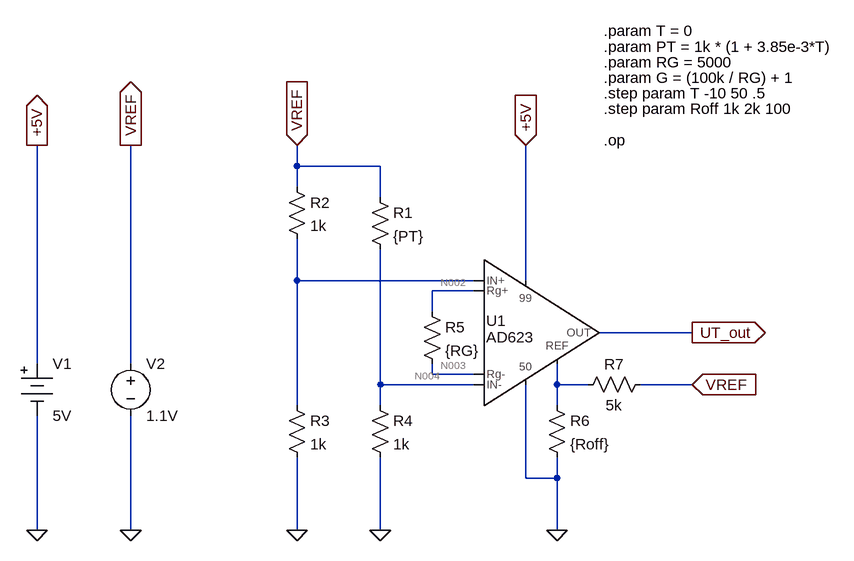
[diagram p0: schematic analog_amplifier.asc]
analog_amplifier.asc, the LTspice schematic file:
Version 4
SHEET 1 880 680
WIRE -96 -128 -96 -160
WIRE 32 -128 -96 -128
WIRE -96 -96 -96 -128
WIRE 32 -80 32 -128
WIRE -96 48 -96 -16
WIRE 176 48 -96 48
WIRE 256 48 256 -160
WIRE 176 64 112 64
WIRE 112 96 112 64
WIRE 512 128 368 128
WIRE -496 176 -496 -160
WIRE -352 176 -352 -160
WIRE 112 192 112 176
WIRE 176 192 112 192
WIRE 32 208 32 0
WIRE 176 208 32 208
WIRE 304 208 304 176
WIRE 352 208 304 208
WIRE 512 208 432 208
WIRE -96 240 -96 48
WIRE 32 240 32 208
WIRE 304 240 304 208
WIRE 256 352 256 208
WIRE 304 352 304 320
WIRE 304 352 256 352
WIRE -496 432 -496 256
WIRE -352 432 -352 256
WIRE -96 432 -96 320
WIRE 32 432 32 320
WIRE 304 432 304 352
FLAG -496 432 0
FLAG -496 -160 +5V
IOPIN -496 -160 Out
FLAG -352 432 0
FLAG -352 -160 VREF
IOPIN -352 -160 Out
FLAG -96 -160 VREF
IOPIN -96 -160 In
FLAG -96 432 0
FLAG 32 432 0
FLAG 304 432 0
FLAG 256 -160 +5V
IOPIN 256 -160 In
FLAG 512 128 UT_out
IOPIN 512 128 Out
FLAG 512 208 VREF
IOPIN 512 208 In
SYMBOL ad623 192 128 R0
WINDOW 3 3 7 Left 2
WINDOW 0 3 -18 Left 2
SYMATTR InstName U1
SYMBOL Misc\\battery -496 160 R0
WINDOW 123 0 0 Left 0
WINDOW 39 0 0 Left 0
SYMATTR InstName V1
SYMATTR Value 5V
SYMBOL voltage -352 160 R0
WINDOW 123 0 0 Left 0
WINDOW 39 0 0 Left 0
SYMATTR InstName V2
SYMATTR Value 1.1V
SYMBOL res 16 -96 R0
SYMATTR InstName R1
SYMATTR Value {PT}
SYMBOL res -112 -112 R0
SYMATTR InstName R2
SYMATTR Value 1k
SYMBOL res -112 224 R0
SYMATTR InstName R3
SYMATTR Value 1k
SYMBOL res 16 224 R0
SYMATTR InstName R4
SYMATTR Value 1k
SYMBOL res 96 80 R0
SYMATTR InstName R5
SYMATTR Value {RG}
SYMBOL res 288 224 R0
SYMATTR InstName R6
SYMATTR Value {Roff}
SYMBOL res 448 192 R90
WINDOW 0 0 56 VBottom 2
WINDOW 3 32 56 VTop 2
SYMATTR InstName R7
SYMATTR Value 5k
TEXT 376 -336 Left 2 !.param T = 0
TEXT 376 -312 Left 2 !.param PT = 1k * (1 + 3.85e-3*T)
TEXT 376 -288 Left 2 !.param RG = 5000
TEXT 376 -264 Left 2 !.param G = (100k / RG) + 1
TEXT 376 -240 Left 2 !.step param T -10 50 .5
TEXT 376 -168 Left 2 !.op
TEXT 376 -216 Left 2 !.step param Roff 1k 2k 100

The netlist it stands for:
* analog_amplifier.asc
XU1 N001 N004 N002 N003 +5V 0 UT_out N005 AD623  ; pins IN+ IN- Rg+ Rg- 99 50 OUT REF
V1 +5V 0 5V
V2 VREF 0 1.1V
R1 VREF N004 {PT}
R2 VREF N001 1k
R3 N001 0 1k
R4 N004 0 1k
R5 N002 N003 {RG}
R6 N005 0 {Roff}
R7 VREF N005 5k
.param T = 0
.param PT = 1k * (1 + 3.85e-3*T)
.param RG = 5000
.param G = (100k / RG) + 1
.step param T -10 50 .5
.op
.step param Roff 1k 2k 100
.lib ad623.cir
.backanno
.end

* Results of the author's LTspice run, read from the files saved beside the schematic
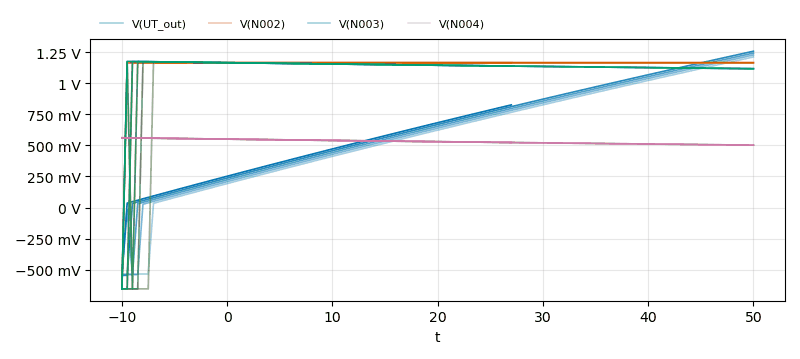
[diagram p1: Operating Point of analog_amplifier.asc, plotted from the saved traces]
* Operating Point, 5 runs:
*   V(UT_out) [roff=1000]: -533.8 mV at t=-10 , 1.21 V at t=50 , min -533.8 mV, max 1.21 V
*   V(UT_out) [roff=1100]: -538.6 mV at t=-10 , 1.226 V at t=50 , min -538.6 mV, max 1.226 V
*   V(UT_out) [roff=1200]: -542.2 mV at t=-10 , 1.242 V at t=50 , min -542.2 mV, max 1.242 V
*   V(UT_out) [roff=1300]: -545 mV at t=-10 , 1.256 V at t=50 , min -545 mV, max 1.256 V
*   V(UT_out) [roff=1400]: -547 mV at t=-10 , 825.2 mV at t=27 , min -547 mV, max 825.2 mV
*   V(N002) [roff=1000]: -653.2 mV at t=-10 , 1.164 V at t=50 , min -653.2 mV, max 1.164 V
*   V(N002) [roff=1100]: -653.2 mV at t=-10 , 1.164 V at t=50 , min -653.2 mV, max 1.164 V
*   V(N002) [roff=1200]: -653.2 mV at t=-10 , 1.164 V at t=50 , min -653.2 mV, max 1.164 V
*   V(N002) [roff=1300]: -653.2 mV at t=-10 , 1.164 V at t=50 , min -653.2 mV, max 1.164 V
*   V(N002) [roff=1400]: -653.2 mV at t=-10 , 1.164 V at t=27 , min -653.2 mV, max 1.164 V
*   V(N003) [roff=1000]: -653.2 mV at t=-10 , 1.116 V at t=50 , min -653.2 mV, max 1.172 V
*   V(N003) [roff=1100]: -653.2 mV at t=-10 , 1.116 V at t=50 , min -653.2 mV, max 1.173 V
*   V(N003) [roff=1200]: -653.2 mV at t=-10 , 1.116 V at t=50 , min -653.2 mV, max 1.175 V
*   V(N003) [roff=1300]: -653.2 mV at t=-10 , 1.116 V at t=50 , min -653.2 mV, max 1.174 V
*   V(N003) [roff=1400]: -653.2 mV at t=-10 , 1.137 V at t=27 , min -653.2 mV, max 1.175 V
*   V(N004) [roff=1000]: 560.8 mV at t=-10 , 501.7 mV at t=50 , min 501.7 mV, max 560.8 mV
*   V(N004) [roff=1100]: 560.8 mV at t=-10 , 501.7 mV at t=50 , min 501.7 mV, max 560.8 mV
*   V(N004) [roff=1200]: 560.8 mV at t=-10 , 501.7 mV at t=50 , min 501.7 mV, max 560.8 mV
*   V(N004) [roff=1300]: 560.8 mV at t=-10 , 501.7 mV at t=50 , min 501.7 mV, max 560.8 mV
*   V(N004) [roff=1400]: 560.8 mV at t=-10 , 522.8 mV at t=27 , min 522.8 mV, max 560.8 mV
* From the log:
*   Semiconductor Device Operating Points:
*                           --- Diodes ---
*   Name:   d:u1:n1d    d:u1:n1c    d:u1:n1b     d:u1:6d     d:u1:5d
*   Model:  u1:dnoi1    u1:dnoi1    u1:dnoi1      u1:dx       u1:dx
*   Id:      5.57e-04    5.57e-04    5.57e-04   -6.29e-13   -3.17e-12
*   Vd:      6.40e-01    6.40e-01    6.40e-01   -6.29e-01   -3.17e+00
*   Req:     4.64e+01    4.64e+01    4.64e+01    1.00e+12    1.00e+12
*   CAP:     0.00e+00    0.00e+00    0.00e+00    0.00e+00    0.00e+00
*   Name:    d:u1:2d     d:u1:1d     d:u1:6c     d:u1:5c     d:u1:2c
*   Model:    u1:dx       u1:dx       u1:dx       u1:dx       u1:dx
*   Id:     -2.50e-12   -2.50e-12   -6.29e-13   -3.17e-12   -2.50e-12
*   Vd:     -2.50e+00   -2.50e+00   -6.29e-01   -3.17e+00   -2.50e+00
*   Req:     1.00e+12    1.00e+12    1.00e+12    1.00e+12    1.00e+12
*   CAP:     0.00e+00    0.00e+00    0.00e+00    0.00e+00    0.00e+00
*   Name:    d:u1:1c     d:u1:6b     d:u1:5b     d:u1:2b     d:u1:1b
*   Model:    u1:dx       u1:dx       u1:dx       u1:dx       u1:dx
*   Id:     -2.50e-12   -1.33e-12   -2.47e-12    1.44e-08   -5.49e-12
*   Vd:     -2.50e+00   -1.33e+00   -2.47e+00    4.86e-01   -5.49e+00
*   Req:     1.00e+12    1.00e+12    1.00e+12    1.80e+06    1.00e+12
*   CAP:     0.00e+00    0.00e+00    0.00e+00    0.00e+00    0.00e+00
*                           --- Bipolar Transistors ---
*   Name:     q:u1:4d     q:u1:4c     q:u1:4b     q:u1:3d     q:u1:3c
*   Model:    u1:qnox     u1:qnox     u1:qnox     u1:qpox     u1:qpox
*   Ib:      -1.04e-11   -1.04e-11   -9.76e-12   -2.04e-01   -2.04e-01
*   Ic:       4.62e-12    4.62e-12    4.62e-12    2.01e-05    2.31e-05
*   Vbe:     -5.76e+00   -5.76e+00   -5.14e+00   -8.23e-01   -8.23e-01
*   Vbc:     -4.61e+00   -4.61e+00   -4.61e+00   -8.06e-01   -8.07e-01
*   Vce:     -1.15e+00   -1.15e+00   -5.34e-01   -1.70e-02   -1.69e-02
*   BetaDC:  -4.45e-01   -4.45e-01   -4.73e-01   -9.84e-05   -1.13e-04
*   Gm:      -8.27e-91   -8.23e-91   -9.60e-91    7.76e+00    7.76e+00
*   Rpi:      1.00e+12    1.00e+12    1.00e+12    7.19e+00    7.19e+00
*   Rx:       0.00e+00    0.00e+00    0.00e+00    0.00e+00    0.00e+00
*   Ro:       1.21e+90    1.22e+90    1.04e+90    1.30e-01    1.30e-01
*   Cbe:      0.00e+00    0.00e+00    0.00e+00    0.00e+00    0.00e+00
*   Cbc:      0.00e+00    0.00e+00    0.00e+00    0.00e+00    0.00e+00
*   Cjs:      0.00e+00    0.00e+00    0.00e+00    0.00e+00    0.00e+00
*   BetaAC:  -8.27e-79   -8.23e-79   -9.60e-79    5.58e+01    5.58e+01
*   Cbx:      0.00e+00    0.00e+00    0.00e+00    0.00e+00    0.00e+00
*   Ft:       0.00e+00    0.00e+00    0.00e+00    0.00e+00    0.00e+00
*   Name:     q:u1:3b     q:u1:2d     q:u1:1d     q:u1:2c     q:u1:1c
*   Model:    u1:qpox     u1:qpi      u1:qpi      u1:qpi      u1:qpi
*   Ib:      -1.84e-01   -9.87e-06    2.33e-12   -9.87e-06    2.31e-12
*   Ic:      -2.03e-06   -1.28e-07   -1.17e-12   -1.28e-07   -1.16e-12
*   Vbe:     -8.21e-01   -6.72e-01    1.16e+00   -6.72e-01    1.14e+00
*   Vbc:     -8.03e-01   -6.54e-01    1.17e+00   -6.54e-01    1.16e+00
*   Vce:     -1.81e-02   -1.82e-02   -1.93e-02   -1.82e-02   -1.93e-02
*   BetaDC:   1.11e-05    1.30e-02   -5.04e-01    1.30e-02   -5.04e-01
*   Gm:       6.98e+00    3.79e-04    8.25e-35    3.79e-04    1.25e-34
*   Rpi:      7.99e+00    1.32e+05    1.00e+12    1.32e+05    1.00e+12
*   Rx:       0.00e+00    0.00e+00    0.00e+00    0.00e+00    0.00e+00
*   Ro:       1.44e-01    2.69e+03    1.34e+34    2.69e+03    8.84e+33
*   Cbe:      0.00e+00    0.00e+00    0.00e+00    0.00e+00    0.00e+00
*   Cbc:      0.00e+00    0.00e+00    0.00e+00    0.00e+00    0.00e+00
*   Cjs:      0.00e+00    0.00e+00    0.00e+00    0.00e+00    0.00e+00
*   BetaAC:   5.58e+01    5.01e+01    8.25e-23    5.01e+01    1.25e-22
*   Cbx:      0.00e+00    0.00e+00    0.00e+00    0.00e+00    0.00e+00
*   Ft:       0.00e+00    0.00e+00    0.00e+00    0.00e+00    0.00e+00
*   Name:     q:u1:2b     q:u1:1b    q:u1:in2    q:u1:in1
*   Model:    u1:qpi      u1:qpi      u1:qpi2     u1:qpi1
*   Ib:      -8.19e-06   -1.70e-08   -1.97e-08   -1.97e-08
*   Ic:      -1.64e-06   -1.56e-07   -1.98e-06   -1.98e-06
*   Vbe:     -6.70e-01   -5.52e-01   -6.13e-01   -6.13e-01
*   Vbc:     -6.49e-01   -4.87e-01    5.61e-01    5.50e-01
*   Vce:     -2.05e-02   -6.50e-02   -1.17e+00   -1.16e+00
*   BetaDC:   2.00e-01    9.15e+00    1.01e+02    1.01e+02
*   Gm:       3.73e-04    6.61e-06    7.65e-05    7.65e-05
*   Rpi:      1.46e+05    1.38e+07    1.31e+06    1.31e+06
*   Rx:       0.00e+00    0.00e+00    0.00e+00    0.00e+00
*   Ro:       3.25e+03    1.71e+06    5.04e+07    5.08e+07
*   Cbe:      0.00e+00    0.00e+00    0.00e+00    0.00e+00
*   Cbc:      0.00e+00    0.00e+00    0.00e+00    0.00e+00
*   Cjs:      0.00e+00    0.00e+00    0.00e+00    0.00e+00
*   BetaAC:   5.44e+01    9.14e+01    1.01e+02    1.01e+02
*   Cbx:      0.00e+00    0.00e+00    0.00e+00    0.00e+00
*   Ft:       0.00e+00    0.00e+00    0.00e+00    0.00e+00